# Altium schematic sheet PJ_GRA_F.SchDoc
size A2; SheetNumber: 1; SheetTotal: 1
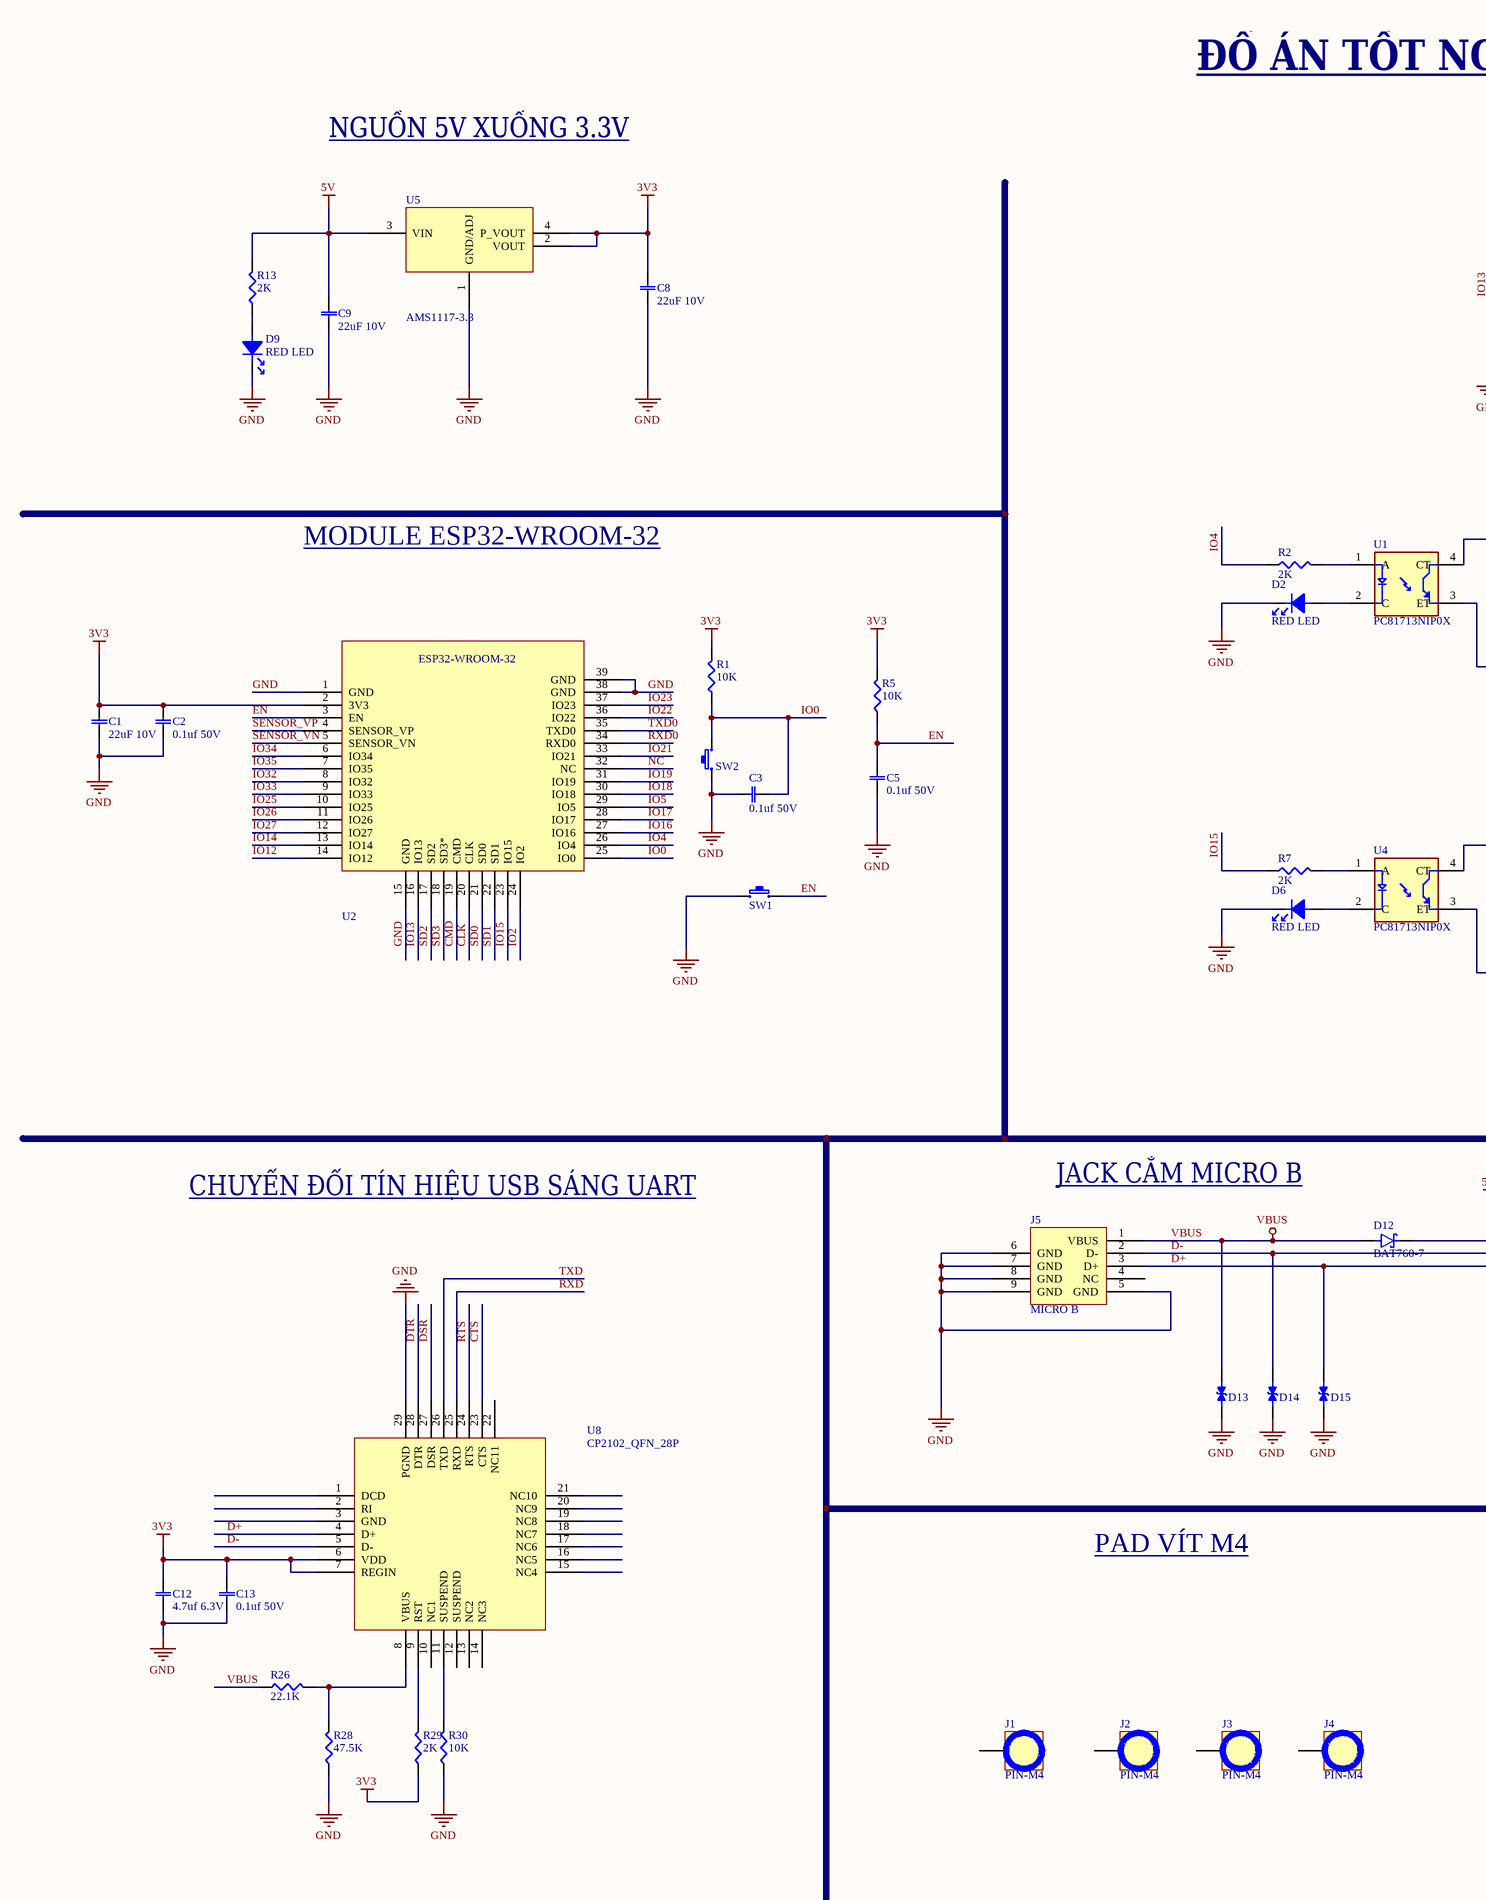
[diagram p0: PJ_GRA_F.SchDoc, left]
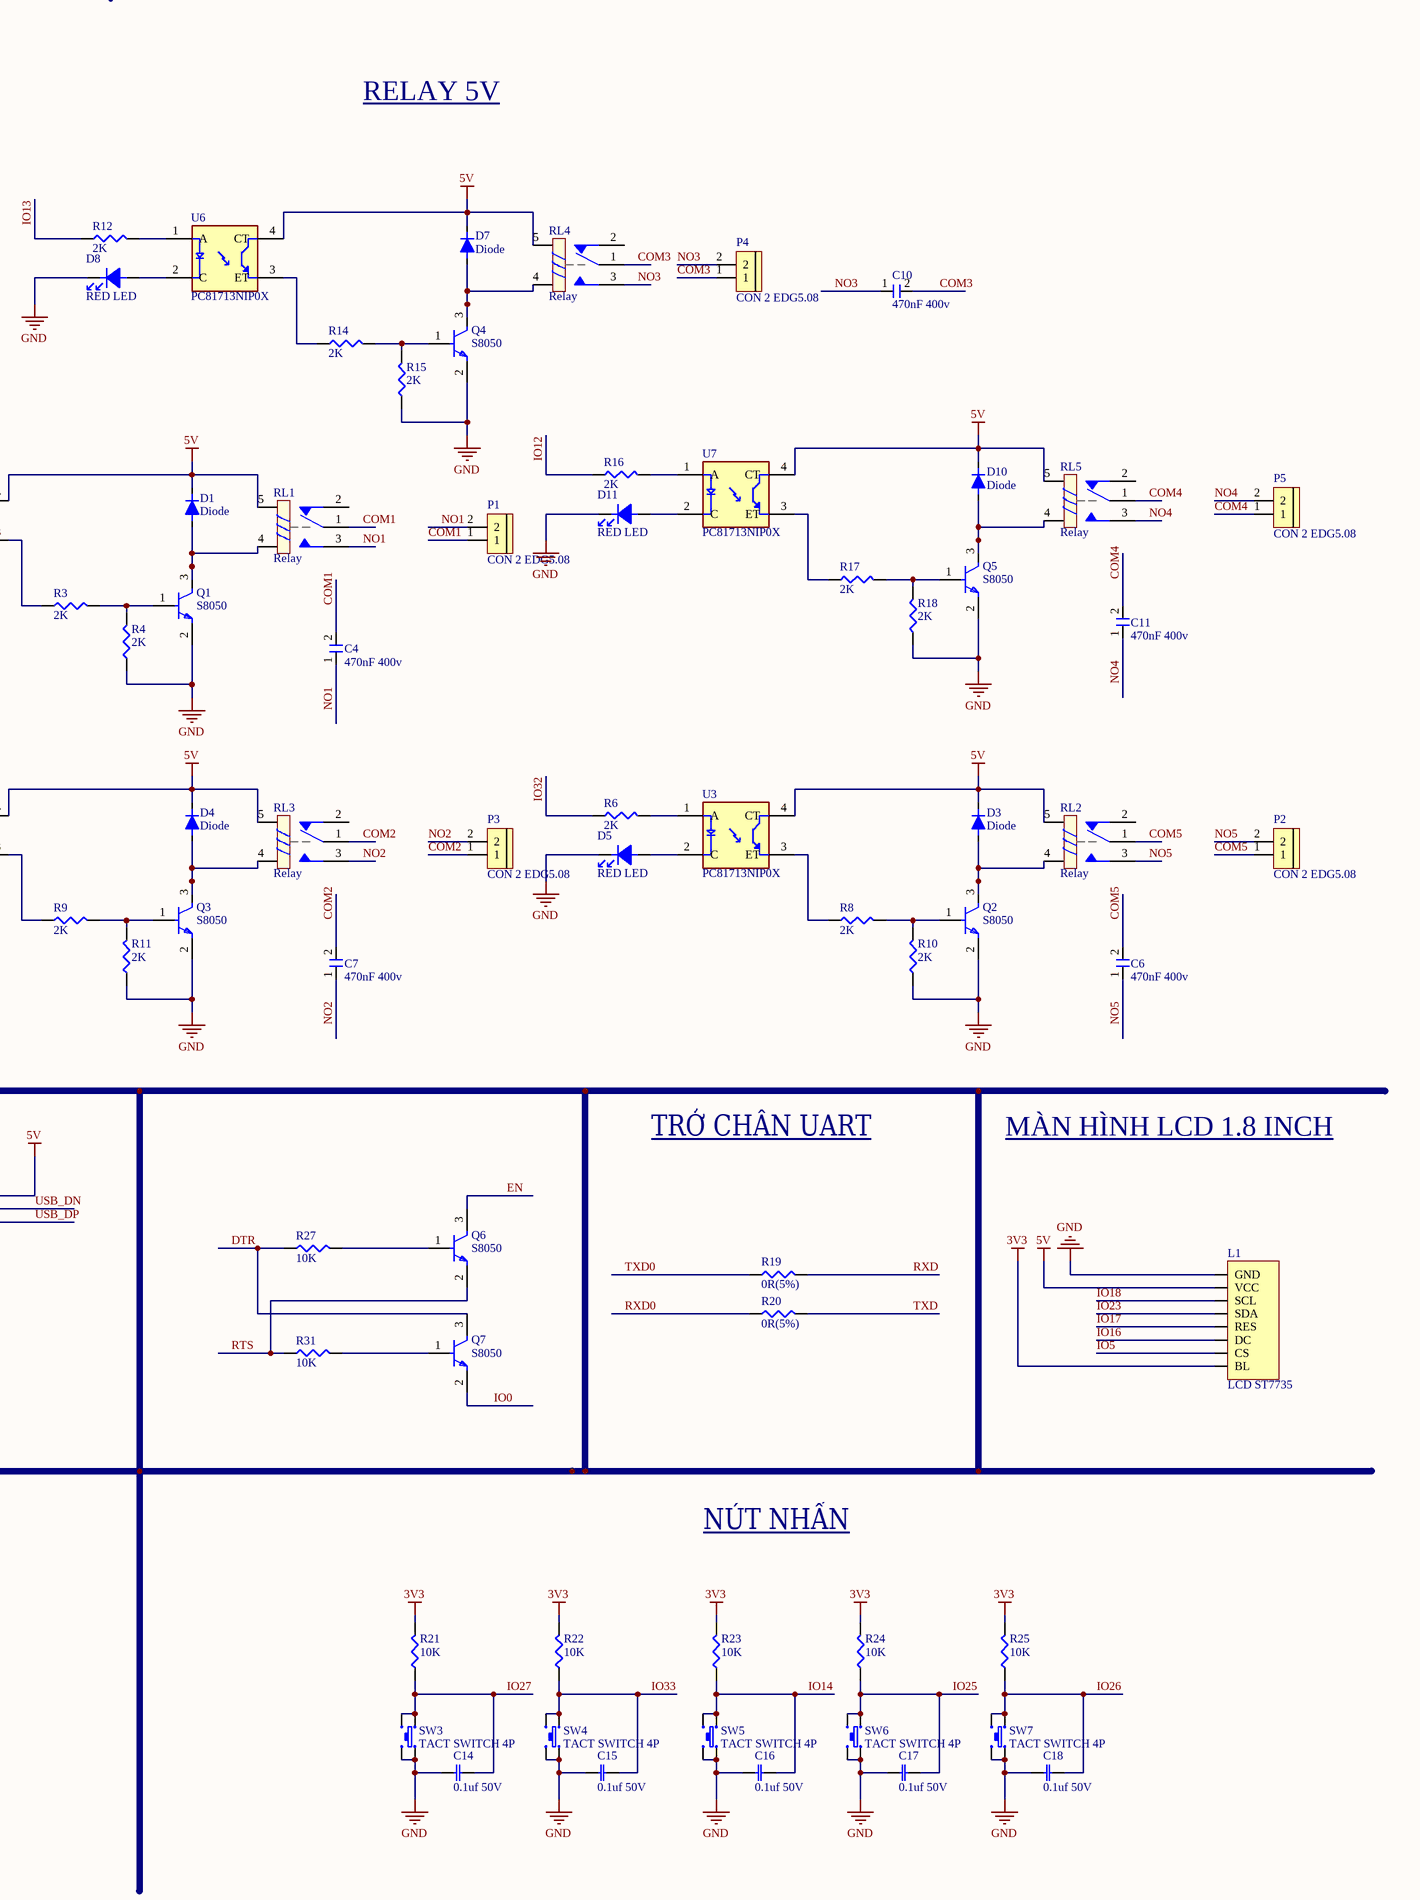
[diagram p1: PJ_GRA_F.SchDoc, right]

## Parts
C1  22uF 10V  [FP-GRM188-0_2-IPC_A]
C2  0.1uf 50V  [FP-C1005-050-0_05-IPC_A]
C3  0.1uf 50V  [FP-C1005-050-0_05-IPC_A]
C4  470nF 400v  [CAPRR750W80L1900T780H2200]
C5  0.1uf 50V  [FP-C1005-050-0_05-IPC_A]
C6  470nF 400v  [CAPRR750W80L1900T780H2200]
C7  470nF 400v  [CAPRR750W80L1900T780H2200]
C8  22uF 10V  [FP-GRM188-0_2-IPC_A]
C9  22uF 10V  [FP-GRM188-0_2-IPC_A]
C10  470nF 400v  [CAPRR750W80L1900T780H2200]
C11  470nF 400v  [CAPRR750W80L1900T780H2200]
C12  4.7uf 6.3V  [FP-C1005-050-0_05-IPC_A]
C13  0.1uf 50V  [FP-C1005-050-0_05-IPC_A]
C14  0.1uf 50V  [FP-C1005-050-0_05-IPC_A]
C15  0.1uf 50V  [FP-C1005-050-0_05-IPC_A]
C16  0.1uf 50V  [FP-C1005-050-0_05-IPC_A]
C17  0.1uf 50V  [FP-C1005-050-0_05-IPC_A]
C18  0.1uf 50V  [FP-C1005-050-0_05-IPC_A]
D1  Diode  [DO-214AC_SMA]
D2  RED LED  [FP-6_541-5092_01-4-MFG]
D3  Diode  [DO-214AC_SMA]
D4  Diode  [DO-214AC_SMA]
D5  RED LED  [FP-6_541-5092_01-4-MFG]
D6  RED LED  [FP-6_541-5092_01-4-MFG]
D7  Diode  [DO-214AC_SMA]
D8  RED LED  [FP-6_541-5092_01-4-MFG]
D9  RED LED  [FP-6_541-5092_01-4-MFG]
D10  Diode  [DO-214AC_SMA]
D11  RED LED  [FP-6_541-5092_01-4-MFG]
D12  BAT760-7  [SOD2513X120N]
D13  DIODE  [TVS_LESD5D5.0CT1G]  (value not drawn)
D14  DIODE  [TVS_LESD5D5.0CT1G]  (value not drawn)
D15  DIODE  [TVS_LESD5D5.0CT1G]  (value not drawn)
J1  PIN-M4  [M4]
J2  PIN-M4  [M4]
J3  PIN-M4  [M4]
J4  PIN-M4  [M4]
J5  MICRO B  [HRS_ZX62D-B-5P8]
L1  LCD ST7735  [ST7735 (OLED -1.8 inch)]
P1  CON 2 EDG5.08  [CON 2 2EDG5.08]
P2  CON 2 EDG5.08  [CON 2 2EDG5.08]
P3  CON 2 EDG5.08  [CON 2 2EDG5.08]
P4  CON 2 EDG5.08  [CON 2 2EDG5.08]
P5  CON 2 EDG5.08  [CON 2 2EDG5.08]
Q1  S8050  [FP-SS8050-G-IPC_C]
Q2  S8050  [FP-SS8050-G-IPC_C]
Q3  S8050  [FP-SS8050-G-IPC_C]
Q4  S8050  [FP-SS8050-G-IPC_C]
Q5  S8050  [FP-SS8050-G-IPC_C]
Q6  S8050  [FP-SS8050-G-IPC_C]
Q7  S8050  [FP-SS8050-G-IPC_C]
R1  10K  [FP-AC0402-IPC_A]
R2  2K  [FP-AC0402-IPC_A]
R3  2K  [FP-AC0402-IPC_A]
R4  2K  [FP-AC0402-IPC_A]
R5  10K  [FP-AC0402-IPC_A]
R6  2K  [FP-AC0402-IPC_A]
R7  2K  [FP-AC0402-IPC_A]
R8  2K  [FP-AC0402-IPC_A]
R9  2K  [FP-AC0402-IPC_A]
R10  2K  [FP-AC0402-IPC_A]
R11  2K  [FP-AC0402-IPC_A]
R12  2K  [FP-AC0402-IPC_A]
R13  2K  [FP-AC0402-IPC_A]
R14  2K  [FP-AC0402-IPC_A]
R15  2K  [FP-AC0402-IPC_A]
R16  2K  [FP-AC0402-IPC_A]
R17  2K  [FP-AC0402-IPC_A]
R18  2K  [FP-AC0402-IPC_A]
R19  0R(5%)  [FP-AC0402-IPC_A]
R20  0R(5%)  [FP-AC0402-IPC_A]
R21  10K  [FP-AC0402-IPC_A]
R22  10K  [FP-AC0402-IPC_A]
R23  10K  [FP-AC0402-IPC_A]
R24  10K  [FP-AC0402-IPC_A]
R25  10K  [FP-AC0402-IPC_A]
R26  22.1K  [FP-AC0402-IPC_A]
R27  10K  [FP-AC0402-IPC_A]
R28  47.5K  [FP-AC0402-IPC_A]
R29  2K  [FP-AC0402-IPC_A]
R30  10K  [FP-AC0402-IPC_A]
R31  10K  [FP-AC0402-IPC_A]
RL1  Relay  [Relay 5 Chan SRD]
RL2  Relay  [Relay 5 Chan SRD]
RL3  Relay  [Relay 5 Chan SRD]
RL4  Relay  [Relay 5 Chan SRD]
RL5  Relay  [Relay 5 Chan SRD]
SW1  Tact Switch  [SKRK]  (value not drawn)
SW2  Tact Switch  [SKRK]  (value not drawn)
SW3  TACT SWITCH 4P  [SW_B3F-4055]
SW4  TACT SWITCH 4P  [SW_B3F-4055]
SW5  TACT SWITCH 4P  [SW_B3F-4055]
SW6  TACT SWITCH 4P  [SW_B3F-4055]
SW7  TACT SWITCH 4P  [SW_B3F-4055]
U1  PC81713NIP0X  [SOT254P1025X400-4N]
U2  ESP32-WROOM-32D-N4  [FP-ESP32-WROOM-32D_M113DH-0]  (value not drawn)
U3  PC81713NIP0X  [SOT254P1025X400-4N]
U4  PC81713NIP0X  [SOT254P1025X400-4N]
U5  AMS1117-3.3  [FP-AMS1117-IPC_A]
U6  PC81713NIP0X  [SOT254P1025X400-4N]
U7  PC81713NIP0X  [SOT254P1025X400-4N]
U8  CP2102_QFN_28P  [FP-CP2102N-A01-GQFN28-IPC_A - duplicate]

## Nets
3V3: C1.2 C2.2 C8.2 C12.2 C13.2 L1.8(BL) R1.2 R5.2 R21.2 R22.2 R23.2 R24.2 R25.2 R29.1 U2.2(3V3) U5.2(VOUT) U5.4(P_VOUT) U8.6(VDD) U8.7(REGIN)
5V: C9.2 D1.K D3.K D4.K D7.K D10.K D12.C(K) L1.2(VCC) R13.2 RL1.5 RL2.5 RL3.5 RL4.5 RL5.5 U1.4(CT) U3.4(CT) U4.4(CT) U5.3(VIN) U6.4(CT) U7.4(CT)
GND: C1.1 C2.1 C3.1 C5.1 C8.1 C9.1 C12.1 C13.1 C14.1 C15.1 C16.1 C17.1 C18.1 D2.1 D5.1 D6.1 D8.1 D9.1 D11.1 D13.1 D14.1 D15.1 J5.5(GND) J5.6(GND) J5.7(GND) J5.8(GND) J5.9(GND) L1.1(GND) Q1.2(E) Q2.2(E) Q3.2(E) Q4.2(E) Q5.2(E) R4.1 R10.1 R11.1 R15.1 R18.1 R28.1 R30.1 SW1.2 SW2.2 SW3.2 SW3.4 SW4.2 SW4.4 SW5.2 SW5.4 SW6.2 SW6.4 SW7.2 SW7.4 U2.1(GND) U2.15(GND) U2.38(GND) U2.39(GND) U5.1(GND/ADJ) U8.29(PGND)
VBUS: D12.A D13.2 J5.1(VBUS) R26.1
CLK: U2.20(CLK)
CMD: U2.19(CMD)
COM1: C4.2 P1.1 RL1.1
COM2: C7.2 P3.1 RL3.1
COM3: C10.2 P4.1 RL4.1
COM4: C11.2 P5.1 RL5.1
COM5: C6.2 P2.1 RL2.1
CTS: U8.23(CTS)
D+: D15.2 J5.3(D+) U8.4(D+)  [also labelled USB_DP]
D-: D14.2 J5.2(D-) U8.5(D-)  [also labelled USB_DN]
DSR: U8.27(DSR)
DTR: Q7.3(C) R27.1 U8.28(DTR)
EN: C5.2 Q6.3(C) R5.1 SW1.1 U2.3(EN)
IO0: C3.2 Q7.2(E) R1.1 SW2.1 U2.25(IO0)
IO2: U2.24(IO2)
IO4: R2.1 U2.26(IO4)
IO5: L1.7(CS) U2.29(IO5)
IO12: R16.1 U2.14(IO12)
IO13: R12.1 U2.16(IO13)
IO14: C16.2 R23.1 SW5.1 SW5.3 U2.13(IO14)
IO15: R7.1 U2.23(IO15)
IO16: L1.6(DC) U2.27(IO16)
IO17: L1.5(RES) U2.28(IO17)
IO18: L1.3(SCL) U2.30(IO18)
IO19: U2.31(IO19)
IO21: U2.33(IO21)
IO22: U2.36(IO22)
IO23: L1.4(SDA) U2.37(IO23)
IO25: C17.2 R24.1 SW6.1 SW6.3 U2.10(IO25)
IO26: C18.2 R25.1 SW7.1 SW7.3 U2.11(IO26)
IO27: C14.2 R21.1 SW3.1 SW3.3 U2.12(IO27)
IO32: R6.1 U2.8(IO32)
IO33: C15.2 R22.1 SW4.1 SW4.3 U2.9(IO33)
IO34: U2.6(IO34)
IO35: U2.7(IO35)
NC: U2.32(NC)
NO1: C4.1 P1.2 RL1.3
NO2: C7.1 P3.2 RL3.3
NO3: C10.1 P4.2 RL4.3
NO4: C11.1 P5.2 RL5.3
NO5: C6.1 P2.2 RL2.3
RTS: Q6.2(E) R31.1 U8.24(RTS)
RXD: R19.2 U8.25(RXD)
RXD0: R20.1 U2.34(RXD0)
SD0: U2.21(SD0)
SD1: U2.22(SD1)
SD2: U2.17(SD2)
SD3: U2.18(SD3*)
SENSOR_VN: U2.5(SENSOR_VN)
SENSOR_VP: U2.4(SENSOR_VP)
TXD: R20.2 U8.26(TXD)
TXD0: R19.1 U2.35(TXD0)
NetD1_A: D1.A Q1.3(C) RL1.4
NetD2_2: D2.2 U1.2(C)
NetD3_A: D3.A Q2.3(C) RL2.4
NetD4_A: D4.A Q3.3(C) RL3.4
NetD5_2: D5.2 U3.2(C)
NetD6_2: D6.2 U4.2(C)
NetD7_A: D7.A Q4.3(C) RL4.4
NetD8_2: D8.2 U6.2(C)
NetD9_2: D9.2 R13.1
NetD10_A: D10.A Q5.3(C) RL5.4
NetD11_2: D11.2 U7.2(C)
NetQ1_1: Q1.1(B) R3.2 R4.2
NetQ2_1: Q2.1(B) R8.2 R10.2
NetQ3_1: Q3.1(B) R9.2 R11.2
NetQ4_1: Q4.1(B) R14.2 R15.2
NetQ5_1: Q5.1(B) R17.2 R18.2
NetQ6_1: Q6.1(B) R27.2
NetQ7_1: Q7.1(B) R31.2
NetR2_2: R2.2 U1.1(A)
NetR3_1: R3.1 U1.3(ET)
NetR6_2: R6.2 U3.1(A)
NetR7_2: R7.2 U4.1(A)
NetR8_1: R8.1 U3.3(ET)
NetR9_1: R9.1 U4.3(ET)
NetR12_2: R12.2 U6.1(A)
NetR14_1: R14.1 U6.3(ET)
NetR16_2: R16.2 U7.1(A)
NetR17_1: R17.1 U7.3(ET)
NetR26_2: R26.2 R28.2 U8.8(VBUS)
NetR29_2: R29.2 U8.9(RST)
NetR30_2: R30.2 U8.11(SUSPEND)

Not connected (* = marked no-connect by the designer): J1 1; J2 1; J3 1; J4 1; J5 4(NC); RL1 2; RL2 2; RL3 2; RL4 2; RL5 2; U8 1(DCD) 2(RI) 3(GND) 10(NC1) 12(SUSPEND) 13(NC2) 14(NC3) 15(NC4) 16(NC5) 17(NC6) 18(NC7) 19(NC8) 20(NC9) 21(NC10) 22(NC11)

## Notes on the sheet
- ĐỒ ÁN TỐT NGHIỆP
- NGUỒN 5V XUỐNG 3.3V
- RELAY 5V
- MODULE ESP32-WROOM-32
- CHUYỂN ĐỔI TÍN HIỆU USB SÁNG UART
- JACK CẮM MICRO B
- TRỞ CHÂN UART
- MÀN HÌNH LCD 1.8 INCH
- PAD VÍT M4
- NÚT NHẤN
- (in symbol ESP32-WROOM-32D-N4) ESP32-WROOM-32

## Library data of the parts
C1 C8 C9 = GRM188R60J226MEA0J: CAP CER 22UF 6.3V X5R 0603; Manufacturer: Murata; Material: Ceramic; Tolerance: 20%; Supplier 1: Digikey; Manufacturer Part Number: GRM188R60J226MEA0J; RoHS: Yes; Category: Ceramic Capacitors; Stock 1: 990000; Pricing 1: 10000=0.0366, 20000=0.03467, 30000=0.03274, 50000=0.03082, 100000=0.026, 250000=0.02408 (USD); Mount: Surface Mount; Case/Package: 0603; Case Code (Metric): 1608; Case Code (Imperial): 0603; Weight: 0.000222oz; Min Operating Temperature: -55°C; Max Operating Temperature: 85°C; Package Quantity: 10000; Packaging: Tape and Reel; Capacitance: 22uF; Voltage Rating: 6.3V; Dielectric: X5R; Termination: SMD/SMT; Voltage Rating (DC): 6.3V; Series: GRM; Height: 1mm; Lead Free: Lead Free; RoHS Compliant: Yes; ComponentLink1URL: https://datasheet.ciiva.com/29541/partnumbering-e-01-29541598.pdf?src-supplier=Digikey; ComponentLink1Description: https://datasheet.ciiva.com/29541/partnumbering-e-01-29541598.pdf?src-supplier=Digikey; Supplier Part Number 1: 490-7612-2-ND; LCSC part number: C426040
C2 C3 C5 C13-C18 = C1005X7R1H104K050BB: CAP CER 0.1UF 50V X7R 0402; Manufacturer: TDK; Material: 4241ConductorMaterial; Capacitance: 100nF; Tolerance: 10%; Supplier 1: Digikey; Manufacturer Part Number: C1005X7R1H104K050BB; RoHS: Yes; Category: Ceramic Capacitors; Stock 1: 4299684; Pricing 1: 1=0.1, 10=0.053, 50=0.0302, 100=0.0235, 500=0.01766, 1000=0.01388, 2500=0.01262, 5000=0.01161 (USD); Mount: Surface Mount; Case/Package: 0402; Number of Pins: 2NUMBER; Case Code (Imperial): 0402; Case Code (Metric): 1005; Min Operating Temperature: -55°C; Max Operating Temperature: 125°C; Package Quantity: 1; Voltage Rating: 50V; Packaging: Tape and Reel; Dielectric: X7R; Voltage: 50V; Series: C; Construction: Flat; Length: 1mm; Width: 0.02inch; Height: 0.5mm; Thickness: 0.022inch; Depth: 0.5mm; Radiation Hardening: No; RoHS Compliant: Yes; Reach SVHC Compliant: Unknown; Lead Free: 5697LeadFree; ComponentLink1URL: https://datasheet.ciiva.com/26285/2983c1005x7r1h104k050bb-26285417.pdf?src-supplier=Onlinecomponents.com; ComponentLink1Description: https://datasheet.ciiva.com/26285/2983c1005x7r1h104k050bb-26285417.pdf?src-supplier=Onlinecomponents.com; ComponentLink2URL: https://datasheet.ciiva.com/16427/c1005x7r1h104k050bb-16427685.pdf?src-supplier=Future+Electronics; ComponentLink2Description: https://datasheet.ciiva.com/16427/c1005x7r1h104k050bb-16427685.pdf?src-supplier=Future+Electronics; ComponentLink3URL: https://datasheet.ciiva.com/22725/1913358-22725482.pdf?src-supplier=Element14; ComponentLink3Description: https://datasheet.ciiva.com/22725/1913358-22725482.pdf?src-supplier=Element14; ComponentLink4URL: https://datasheet.ciiva.com/22725/1913358-22725480.pdf?src-supplier=Element14; ComponentLink4Description: https://datasheet.ciiva.com/22725/1913358-22725480.pdf?src-supplier=Element14; ComponentLink5URL: https://datasheet.ciiva.com/6292/tdkmlcccaprange-6292410.pdf?src-supplier=Digikey; ComponentLink5Description: https://datasheet.ciiva.com/6292/tdkmlcccaprange-6292410.pdf?src-supplier=Digikey; LCSC part number: C2181015
C4 C6 C7 C10 C11 = 470NF: CAP 470nF 400V TH; MP: ECQE4474RJT; Price: None; Availability: Unavailable; Package: None; Value: *
C12 = CL05A475KQ5NRNC: CAP CER 4.7UF 6.3V X5R 0402; Manufacturer: Samsung; Material: 4241ConductorMaterial; Tolerance: 10%; Supplier 1: Avnet; Manufacturer Part Number: CL05A475KQ5NRNC; RoHS: Yes; Category: Ceramic Capacitors; Stock 1: 2440000; Pricing 1: 10000=0.00979 (USD); Mount: Surface Mount; Case/Package: 0402; Case Code (Metric): 1005; Case Code (Imperial): 0402; Min Operating Temperature: -55°C; Max Operating Temperature: 85°C; Package Quantity: 1; Packaging: Tape and Reel; Capacitance: 4.7uF; Voltage Rating: 6.3V; Dielectric: X5R; Series: CL; Construction: Flat; Length: 1mm; Width: 0.02inch; Height: 0.5mm; Thickness: 0.022inch; Depth: 0.5mm; Radiation Hardening: No; Lead Free: Lead Free; RoHS Compliant: Yes; ComponentLink1URL: https://datasheet.ciiva.com/25793/cl05a475kq5nrnc-25793634.pdf?src-supplier=Digikey; ComponentLink1Description: https://datasheet.ciiva.com/25793/cl05a475kq5nrnc-25793634.pdf?src-supplier=Digikey; ComponentLink2URL: https://datasheet.ciiva.com/26838/getdatasheetpartid-353228-26838196.pdf?src-supplier=Verical; ComponentLink2Description: https://datasheet.ciiva.com/26838/getdatasheetpartid-353228-26838196.pdf?src-supplier=Verical; LCSC part number: C2932473
D1 D3 D4 D7 D10 = M7: DO-214AC/SMA, 1000V, 1.00A; Manufacturer: Diotec; Supplier 1: Arrow Electronics; Manufacturer Part Number: M7; RoHS: Yes; Category: Rectifier Diodes; Stock 1: 202500; Pricing 1: 7500=0.0111, 15000=0.011, 37500=0.0109, 45000=0.0093, 52500=0.0092, 187500=0.008 (USD); ComponentLink1URL: https://datasheet.octopart.com/M7-Diotec-datasheet-113243034.pdf?src-supplier=TME; ComponentLink1Description: https://datasheet.octopart.com/M7-Diotec-datasheet-113243034.pdf?src-supplier=TME
D2 D5 D6 D8 D9 D11 = VLMS1300-GS08: LED RED 0603 SMD; Manufacturer: Vishay Semiconductors; Viewing Angle: 130°; Luminous Intensity: 54mcd; Forward Voltage: 2V; Wavelength: 631nm; Lens Style: Rectangular,Clear; Forward Current: 20mA; Power Rating: 75mW; Number of LEDs: 1; Supplier 1: Avnet; Manufacturer Part Number: VLMS1300-GS08; RoHS: Yes; Category: LEDs; Stock 1: 880; Pricing 1: 1=0.287, 25=0.232, 50=0.166 (USD); Mount: Surface Mount; Case/Package: 0603; Color: Red; Case Code (Metric): 1608; Case Code (Imperial): 0603; Min Operating Temperature: -35°C; Max Operating Temperature: 85°C; Package Quantity: 1; Packaging: Tape and Reel; Illumination Color: Red; Dominant Wavelength: 631nm; Test Current: 20mA; Series: CHipLED; Length: 1.6mm; Width: 0.8mm; Height: 0.8mm; Radiation Hardening: No; Lead Free: Lead Free; RoHS Compliant: Yes; Reach SVHC Compliant: Unknown; ComponentLink1URL: https://datasheet.ciiva.com/26322/vlmo1300-26322153.pdf?src-supplier=Element14; ComponentLink1Description: https://datasheet.ciiva.com/26322/vlmo1300-26322153.pdf?src-supplier=Element14; ComponentLink2URL: https://datasheet.ciiva.com/8028/vlmo1300-8028047.pdf?src-supplier=Element14; ComponentLink2Description: https://datasheet.ciiva.com/8028/vlmo1300-8028047.pdf?src-supplier=Element14; ComponentLink3URL: https://datasheet.ciiva.com/9333/vlmo1300-9333743.pdf?src-supplier=Avnet; ComponentLink3Description: https://datasheet.ciiva.com/9333/vlmo1300-9333743.pdf?src-supplier=Avnet; ComponentLink4URL: https://datasheet.ciiva.com/2114/vlmo1300-2114929.pdf?src-supplier=Digikey; ComponentLink4Description: https://datasheet.ciiva.com/2114/vlmo1300-2114929.pdf?src-supplier=Digikey; ComponentLink5URL: https://datasheet.ciiva.com/16510/vlmo1300-16510985.pdf?src-supplier=Future+Electronics; ComponentLink5Description: https://datasheet.ciiva.com/16510/vlmo1300-16510985.pdf?src-supplier=Future+Electronics; LCSC part number: C83242
D12 = BAT760-7: Schottky Diode,Vrrm=30V, Vr=21V, I=1A, IFSM=5.5A; Manufacturer: Diodes; Supplier 1: Avnet; Manufacturer Part Number: BAT760-7; RoHS: Yes; Category: Rectifier Diodes; Stock 1: 36000; Pricing 1: 3000=0.05096 (USD); ComponentLink1URL: https://datasheet.ciiva.com/8301/ds30498-8301400.pdf?src-supplier=Avnet; ComponentLink1Description: https://datasheet.ciiva.com/8301/ds30498-8301400.pdf?src-supplier=Avnet; ComponentLink2URL: https://datasheet.ciiva.com/4715/ds30498-63155-4715521.pdf?src-supplier=Mouser; ComponentLink2Description: https://datasheet.ciiva.com/4715/ds30498-63155-4715521.pdf?src-supplier=Mouser; ComponentLink3URL: https://datasheet.ciiva.com/1178/ds30498-1178033.pdf?src-supplier=Element14; ComponentLink3Description: https://datasheet.ciiva.com/1178/ds30498-1178033.pdf?src-supplier=Element14; ComponentLink4URL: https://datasheet.ciiva.com/22695/1670989-22695799.pdf?src-supplier=Element14; ComponentLink4Description: https://datasheet.ciiva.com/22695/1670989-22695799.pdf?src-supplier=Element14; ComponentLink5URL: https://datasheet.ciiva.com/914/ds30498-914551.pdf?src-supplier=Digikey; ComponentLink5Description: https://datasheet.ciiva.com/914/ds30498-914551.pdf?src-supplier=Digikey; ComponentLink6URL: https://datasheet.ciiva.com/914/ds30498-914552.pdf?src-supplier=Digikey; ComponentLink6Description: https://datasheet.ciiva.com/914/ds30498-914552.pdf?src-supplier=Digikey; ComponentLink7URL: https://datasheet.ciiva.com/914/ds30498-914553.pdf?src-supplier=Digikey; ComponentLink7Description: https://datasheet.ciiva.com/914/ds30498-914553.pdf?src-supplier=Digikey; LCSC part number: C124187
D13-D15 = AQ3045-01ETG: TVS DIODE 5.3VWM 12VC SOD882; Manufacturer: Littelfuse; Number of Bidirectional Channels: 1; Reverse Standoff Voltage: 5.3V; Min Breakdown Voltage: 6.8V; Peak Pulse Current: 3A; Peak Pulse Power: 40W; Power Line Protection: No; Diode Type: ZENER; Leakage Current: 100nA; Number of Channels: 1NUMBER; Supplier 1: Digikey; Manufacturer Part Number: AQ3045-01ETG; RoHS: Yes; Category: TVS Diodes; Stock 1: 15483; Pricing 1: 1=0.5, 10=0.391, 100=0.2344, 500=0.217, 1000=0.14756, 2000=0.13585, 5000=0.1302 (USD); Mount: Surface Mount; Min Operating Temperature: -55°C; Max Operating Temperature: 150°C; Packaging: Cut Tape; Series: Automotive, AEC-Q101, AQ3045, SPA®; Operating Supply Voltage: 5.3V; RoHS Compliant: Yes; ComponentLink1URL: https://www.littelfuse.com/~/media/electronics/datasheets/tvs_diode_arrays/littelfuse_tvs_diode_array_aq3045_datasheet.pdf.pdf?src-supplier=Digikey; ComponentLink1Description: https://www.littelfuse.com/~/media/electronics/datasheets/tvs_diode_arrays/littelfuse_tvs_diode_array_aq3045_datasheet.pdf.pdf?src-supplier=Digikey; ComponentLink2URL: http://www.littelfuse.com/~/media/electronics/datasheets/tvs_diode_arrays/littelfuse_tvs_diode_array_aq3045_datasheet.pdf.pdf?src-supplier=Digikey; ComponentLink2Description: http://www.littelfuse.com/~/media/electronics/datasheets/tvs_diode_arrays/littelfuse_tvs_diode_array_aq3045_datasheet.pdf.pdf?src-supplier=Digikey; LCSC part number: C3710326
J5 = USB MICRO B 5 PIN: USB 2.0 1.8A 1 Surface Mount，Right Angle 5P Female -30℃~+80℃ Micro-B SMD USB Connectors ROHS; LCSC part number: C668587
L1 = ST7735 (OLED -1.8 inch): 32RGB x 162dot 262K Color with Frame Memory Single-Chip TFT Controller/Driver
P1-P5 = CON 2 EDG5.08: Cắm; Ten_Linh_Kien: CON 2 2EDG5.08-2P 5.08MM ( Xanh Cong); Ma_Hang: MH000759; Ghi_Chu: *; Don_Vi: Con; Kieu_Chan: *; Chung_Loai: Cắm
Q1-Q7 = SS8050-G: TRANS NPN 25V 1.5A SOT23-3; Manufacturer: Comchip; Max Power Dissipation: 300mW; Transition Frequency: 100MHz; Collector-emitter Voltage-Max: 400mV; Collector Base Voltage (VCBO): 40V; Collector Emitter Saturation Voltage: 500mV; Emitter Base Voltage (VEBO): 5V; hFE Min: 200; Number of Elements: 1; Supplier 1: Digikey; Manufacturer Part Number: SS8050-G; RoHS: Yes; Category: Transistors; Stock 1: 89520; Pricing 1: 1=0.29, 10=0.2, 100=0.0978, 500=0.08154, 1000=0.05666 (USD); Mount: Surface Mount; Case/Package: TO-236-3; Max Operating Temperature: 150°C; Packaging: Cut Tape; Max Collector Current: 1.5A; Collector Emitter Breakdown Voltage: 25V; Max Breakdown Voltage: 25V; Series: -; Power Dissipation: 300mW; Height: 1.15mm; RoHS Compliant: Yes; ComponentLink1URL: http://www.comchiptech.com/admin/files/product/SS8050-G RevA181526.pdf?src-supplier=Digikey; ComponentLink1Description: http://www.comchiptech.com/admin/files/product/SS8050-G RevA181526.pdf?src-supplier=Digikey; LCSC part number: C3199946
R1 R5 R21-R25 R27 R30 R31 = AC0402FR-0710KL: RES SMD 10K OHM 1% 1/16W 0402; Manufacturer: Yageo; Resistance: 10kR; Power Rating: 62.5mW; Voltage Rating: 50V; Temperature Coefficient: 100ppm/°C; Max Power Dissipation: 63mW; Supplier 1: Digikey; Manufacturer Part Number: AC0402FR-0710KL; RoHS: Yes; Category: Chip SMD Resistors; Stock 1: 1860000; Pricing 1: 10000=0.00343, 20000=0.00304, 30000=0.00284, 50000=0.00263, 100000=0.00237 (USD); Case/Package: 0402; Case Code (Imperial): 0402; Case Code (Metric): 1005; Size Code: 0402; Min Operating Temperature: -55°C; Max Operating Temperature: 155°C; Tolerance: 1%; Packaging: Tape and Reel; Termination: SMD/SMT; Number of Terminations: 2; Features: Moisture Resistant,Automotive AEC-Q200; Series: AC; Length: 0.039inch; Width: 0.02inch; Height: 0.015inch; Lead Free: Lead Free; RoHS Compliant: Yes; ComponentLink1URL: https://datasheet.ciiva.com/12656/pyu-ac-51-rohs-l-2-12656634.pdf?src-supplier=Mouser; ComponentLink1Description: https://datasheet.ciiva.com/12656/pyu-ac-51-rohs-l-2-12656634.pdf?src-supplier=Mouser; LCSC part number: C144807
R2-R4 R6-R18 R29 = AC0402FR-072KL: RES SMD 2K OHM 1% 1/16W 0402; Manufacturer: Yageo; Power Rating: 62.5mW; Resistance: 2kR; Voltage Rating: 50V; Max Power Dissipation: 63mW; Temperature Coefficient: 100ppm/°C; Supplier 1: Avnet; Manufacturer Part Number: AC0402FR-072KL; RoHS: Yes; Category: Chip SMD Resistors; Stock 1: 10000; Pricing 1: 10000=0.00115 (USD); Case/Package: 0402; Case Code (Imperial): 0402; Case Code (Metric): 1005; Weight: 2.3E-05oz; Size Code: 0402; Min Operating Temperature: -55°C; Max Operating Temperature: 155°C; Tolerance: 1%; Packaging: Tape and Reel; Number of Terminations: 2; Termination: SMD/SMT; Features: Moisture Resistant,Automotive AEC-Q200; Series: AC; Length: 0.039inch; Width: 0.5mm; Height: 0.015inch; Lead Free: Lead Free; RoHS Compliant: Yes; ComponentLink1URL: https://datasheet.ciiva.com/12576/pyu-ac-51-rohs-l-2-12576349.pdf?src-supplier=Mouser; ComponentLink1Description: https://datasheet.ciiva.com/12576/pyu-ac-51-rohs-l-2-12576349.pdf?src-supplier=Mouser; LCSC part number: C144770
R19 R20 = RC0402JR-070RL: GENERAL PURPOSE CHIP RESISTOR Metal Glaze/thick Film, 0.0625W, 0ohm, Surface Mount, 0402; Manufacturer: Yageo; Resistance: 0mR; Power Rating: 62.5mW; Voltage Rating: 50V; Max Power Dissipation: 63mW; Temperature Coefficient: 200ppm/°C; Supplier 1: Avnet; Manufacturer Part Number: RC0402JR-070RL; RoHS: Yes; Category: Chip SMD Resistors; Stock 1: 720000; Pricing 1: 10000=0.0008 (USD); Case/Package: 0402; Contact Plating: Tin,Matte; Case Code (Metric): 1005; Case Code (Imperial): 0402; Size Code: 0402; Min Operating Temperature: -55°C; Max Operating Temperature: 155°C; Tolerance: 5%; Packaging: Tape and Reel; Resistor Type: Thick Film; Package Quantity: 1; Number of Terminations: 2; Termination: SMD/SMT; Features: Moisture Resistant; Series: RC; Technology: THICK FILM; Resistance Tolerance: 5%; Construction: Rectangular; Length: 1mm; Width: 0.02inch; Height: 0.016inch; Depth: 0.5mm; Reach SVHC Compliant: Unknown; Lead Free: 5697LeadFree; Military Standard: Not; RoHS Compliant: Yes; LCSC part number: C60485
R26 = CRCW040222K1FKED: RES 22.1K OHM 1% 1/16W 0402; Manufacturer: Vishay; Resistance: 22.1kR; Temperature Coefficient: 100ppm/°C; Max Power Dissipation: 63mW; Voltage Rating: 50V; Supplier 1: Avnet; Manufacturer Part Number: CRCW040222K1FKED; RoHS: Yes; Category: Chip SMD Resistors; Stock 1: 290000; Pricing 1: 10000=0.00278, 20000=0.00269, 40000=0.0026, 60000=0.00251, 80000=0.00241, 100000=0.0023, 1000000=0.00219 (USD); Case/Package: 0402; Number of Pins: 2; Case Code (Imperial): 0402; Case Code (Metric): 1005; Weight: 2.3E-05oz; Contact Plating: Tin; Min Operating Temperature: -55°C; Max Operating Temperature: 155°C; Tolerance: 1%; Packaging: Tape and Reel; Number of Terminations: 2; Series: CRCW; Power Rating: 63mW; Package Quantity: 10000; Resistor Type: Thick Film; Termination: SMD/SMT; Voltage Rating (DC): 50V; Working Voltage: 50V; Features: Automotive AEC-Q200; Resistance Tolerance: 1%; Construction: Rectangular; Technology: THICK FILM; Length: 1mm; Width: 0.5mm; Height: 0.35mm; Depth: 0.5mm; Ratings: AEC-Q200; Lead Free: Lead Free; RoHS Compliant: Yes; Military Standard: Not; Reach SVHC Compliant: Unknown; ComponentLink1URL: https://datasheet.ciiva.com/11810/0900766b80d98824-11810184.pdf?src-supplier=Rs; ComponentLink1Description: https://datasheet.ciiva.com/11810/0900766b80d98824-11810184.pdf?src-supplier=Rs; ComponentLink2URL: https://datasheet.ciiva.com/7673/1697337-7673245.pdf?src-supplier=Element14; ComponentLink2Description: https://datasheet.ciiva.com/7673/1697337-7673245.pdf?src-supplier=Element14; ComponentLink3URL: https://datasheet.ciiva.com/7673/1697337-7673445.pdf?src-supplier=Element14; ComponentLink3Description: https://datasheet.ciiva.com/7673/1697337-7673445.pdf?src-supplier=Element14; ComponentLink4URL: https://datasheet.ciiva.com/3256/dcrcwe3-3256246.pdf?src-supplier=Avnet; ComponentLink4Description: https://datasheet.ciiva.com/3256/dcrcwe3-3256246.pdf?src-supplier=Avnet; ComponentLink5URL: https://datasheet.ciiva.com/3256/dcrcwe3-3256247.pdf?src-supplier=Avnet; ComponentLink5Description: https://datasheet.ciiva.com/3256/dcrcwe3-3256247.pdf?src-supplier=Avnet; ComponentLink6URL: https://datasheet.ciiva.com/22871/70201119-22871080.pdf?src-supplier=Allied+Electronics; ComponentLink6Description: https://datasheet.ciiva.com/22871/70201119-22871080.pdf?src-supplier=Allied+Electronics; ComponentLink7URL: https://datasheet.ciiva.com/16208/dcrcwe3-16208744.pdf?src-supplier=Future+Electronics; ComponentLink7Description: https://datasheet.ciiva.com/16208/dcrcwe3-16208744.pdf?src-supplier=Future+Electronics; ComponentLink8URL: https://datasheet.ciiva.com/16771/70201119-16771838.pdf?src-supplier=Allied+Electronics; ComponentLink8Description: https://datasheet.ciiva.com/16771/70201119-16771838.pdf?src-supplier=Allied+Electronics; LCSC part number: C3957064
R28 = RC0402FR-0747K5L: RES 47.5K OHM 1% 1/16W 0402; Manufacturer: Yageo; Resistance: 47.5kR; Power Rating: 62.5mW; Voltage Rating: 50V; Temperature Coefficient: 100ppm/°C; Max Power Dissipation: 63mW; Supplier 1: Arrow Electronics; Manufacturer Part Number: RC0402FR-0747K5L; RoHS: Yes; Category: Chip SMD Resistors; Stock 1: 930000; Pricing 1: 10000=0.0016 (USD); Case/Package: 0402; Case Code (Imperial): 0402; Case Code (Metric): 1005; Size Code: 0402; Min Operating Temperature: -55°C; Max Operating Temperature: 155°C; Tolerance: 1%; Packaging: Tape and Reel; Termination: SMD/SMT; Voltage Rating (DC): 50V; Features: Moisture Resistant; Series: RC; Number of Terminations: 2; Resistor Type: Thick Film; Resistance Tolerance: 1%; Lead Free: Lead Free; RoHS Compliant: Yes; Reach SVHC Compliant: No; ComponentLink1URL: https://datasheet.ciiva.com/12667/pyu-rc0402-51-rohs-l-6-r-12667103.pdf?src-supplier=Mouser; ComponentLink1Description: https://datasheet.ciiva.com/12667/pyu-rc0402-51-rohs-l-6-r-12667103.pdf?src-supplier=Mouser; LCSC part number: C137974
RL1-RL5 = Relay 5 Chan SRD: Relay 5 Chan; Ma_Hang: MH009374; Ten: Relay 5V10A SRD-05VDC-SL-C Chính Hãng
SW1 SW2 = Tact Switch  2P: reset button, 2-pin, 3x4x2, SMT
SW3-SW7 = TACT SWITCH 4P: 12x12; MP: B3F-4055; Price: None; Availability: Unavailable; Value: *; Package: None
U1 U3 U4 U6 U7 = PC81713NIP0X: Optoisolator Transistor Output 5000Vrms 1 Channel 4-SMD; MF: SHARP/Socle Technology; MP: PC81713NIP0X; Purchase-URL: https://pricing.snapeda.com/search/part/PC81713NIP0X/?ref=eda; SnapEDA_Link: https://www.snapeda.com/parts/PC81713NIP0X/SHARP%252FSocle+Technology/view-part/?ref=snap; Package: SMD-4 SOCLE Technology; Availability: In Stock; Check_prices: https://www.snapeda.com/parts/PC81713NIP0X/SHARP%252FSocle+Technology/view-part/?ref=eda; Value: *; Price: None
U2 = ESP32-WROOM-32D-N4: Wi-Fi/BT BLE Module ESP32-D0WD, SPI Flash, UART, PCB antenna; Manufacturer: Espressif Systems; Supplier 1: Digikey; Manufacturer Part Number: ESP32-WROOM-32D-N4; RoHS: No; Category: LDO; Pricing 1: 6500=3.8 (USD); ComponentLink1URL: https://datasheet.octopart.com/ESP32-WROOM-32D-N4-Espressif-Systems-datasheet-125773146.pdf?src-supplier=TME; ComponentLink1Description: https://datasheet.octopart.com/ESP32-WROOM-32D-N4-Espressif-Systems-datasheet-125773146.pdf?src-supplier=TME; ComponentLink2URL: https://datasheet.octopart.com/ESP32-WROOM-32D-N4-Espressif-Systems-datasheet-152560788.pdf?src-supplier=SOS+electronic; ComponentLink2Description: https://datasheet.octopart.com/ESP32-WROOM-32D-N4-Espressif-Systems-datasheet-152560788.pdf?src-supplier=SOS+electronic; LCSC part number: C473012; Supplier Part Number 1: 1965-ESP32-WROOM-32D-N4TR-ND
U5 = AMS1117-3.3 (2): IC Ldo Reg 3.3V 1A SOT223; Manufacturer: Revvo; Supplier 1: Digikey; Manufacturer Part Number: AMS1117-3.3; RoHS: No; Pricing 1: 1=0.43, 10=0.349, 25=0.3196, 100=0.2379, 250=0.2156, 500=0.17844, 1000=0.13382 (USD); LCSC part number: C347222
U8 = CP2102N-A01-GQFN28: USB-to-UART,USB2.0 full speed, data rate up to 3M baud; LCSC part number: C105167